# Altium schematic sheet ANALOG_CIRCUITS.SchDoc
size 482 x 304 mm; SheetNumber: 9; SheetTotal: 14
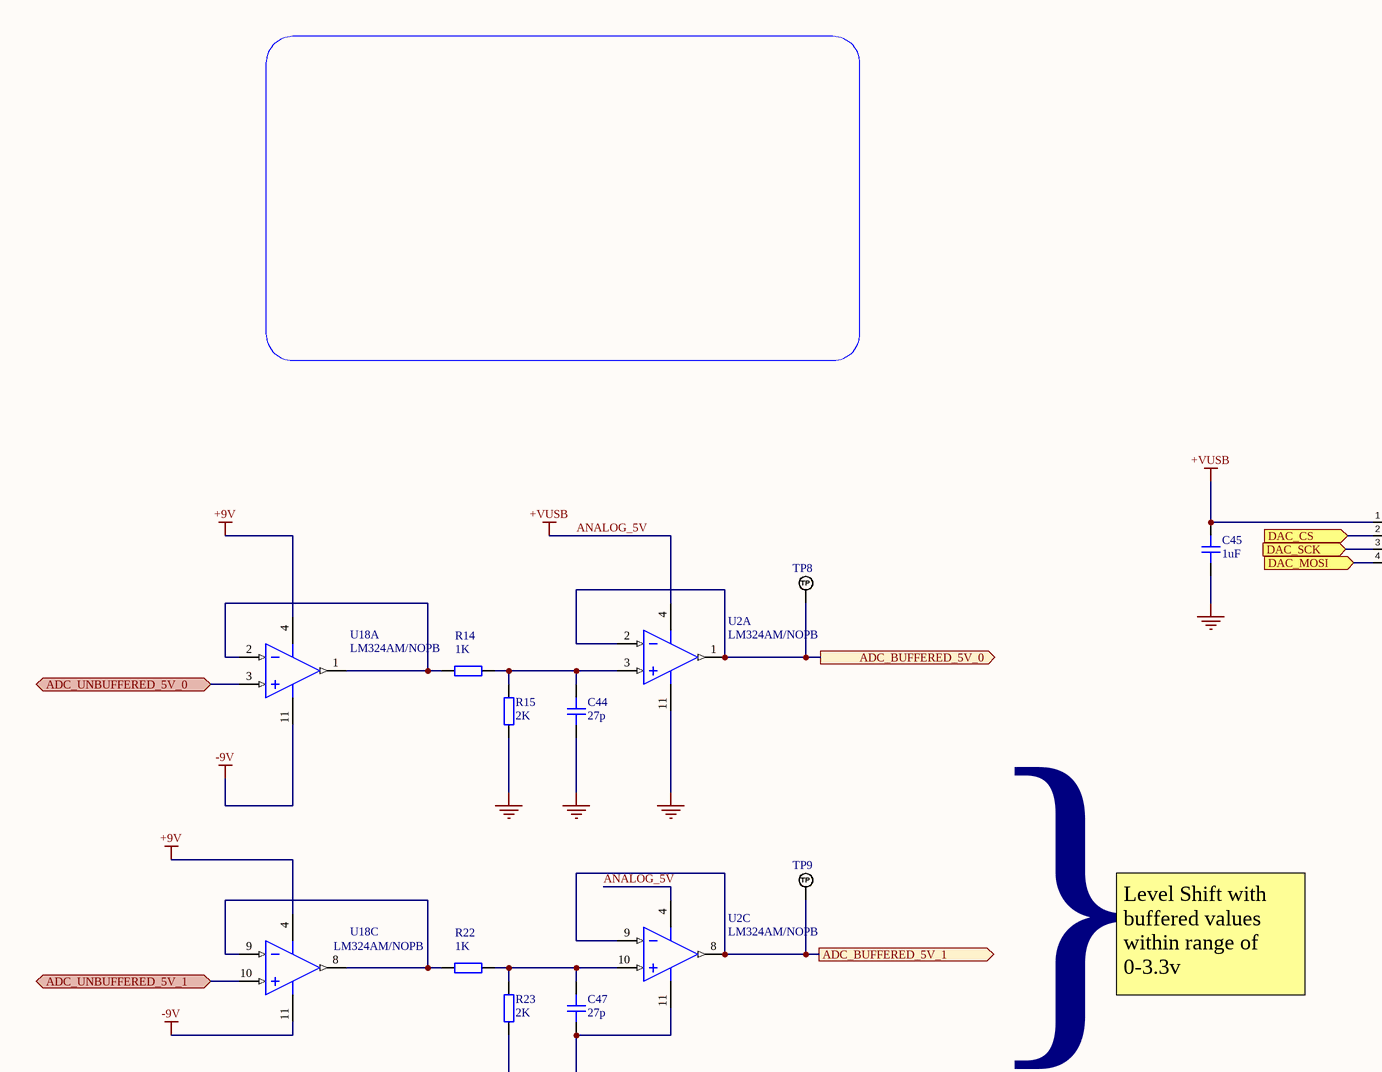
[diagram p0: ANALOG_CIRCUITS.SchDoc, top left]
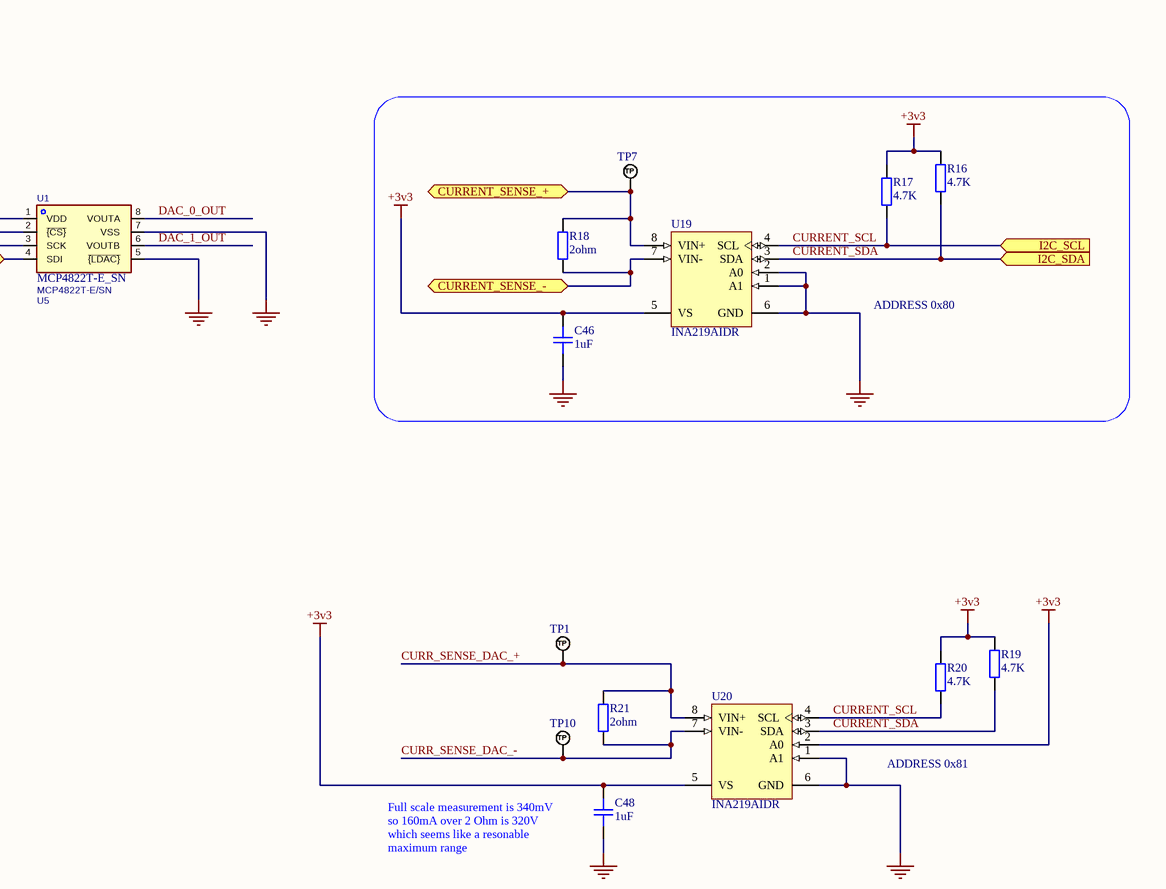
[diagram p1: ANALOG_CIRCUITS.SchDoc, top right]
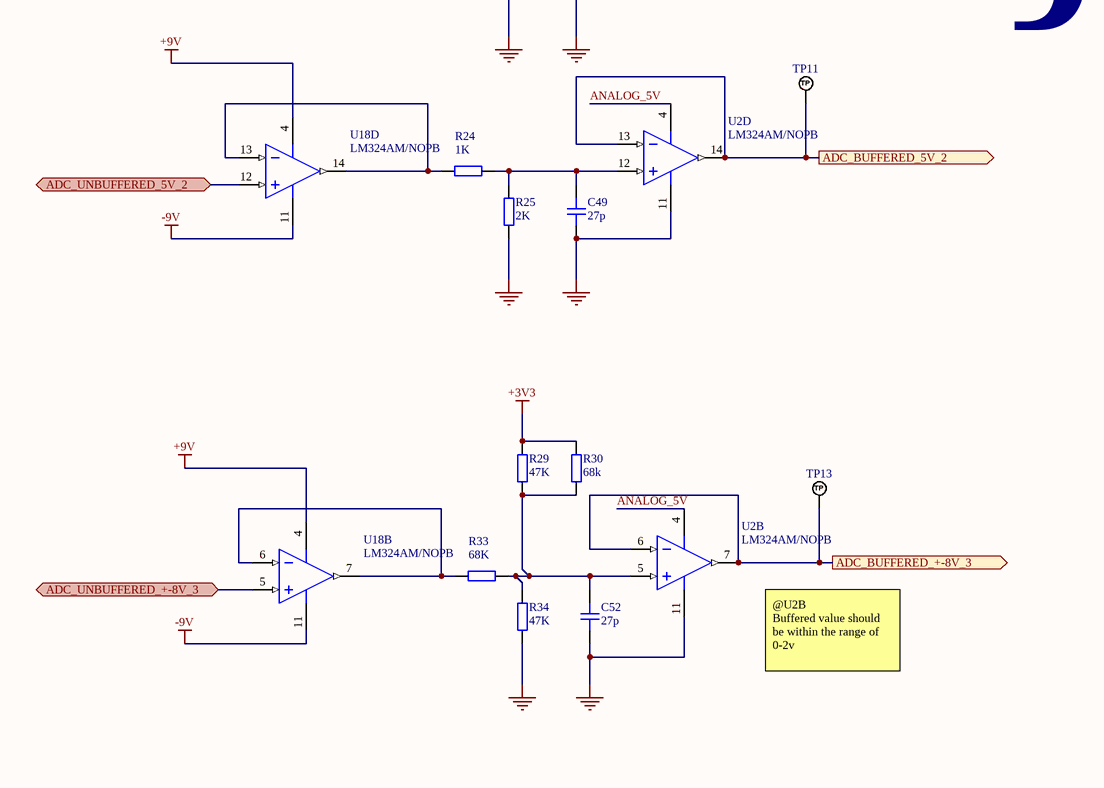
[diagram p2: ANALOG_CIRCUITS.SchDoc, bottom left]
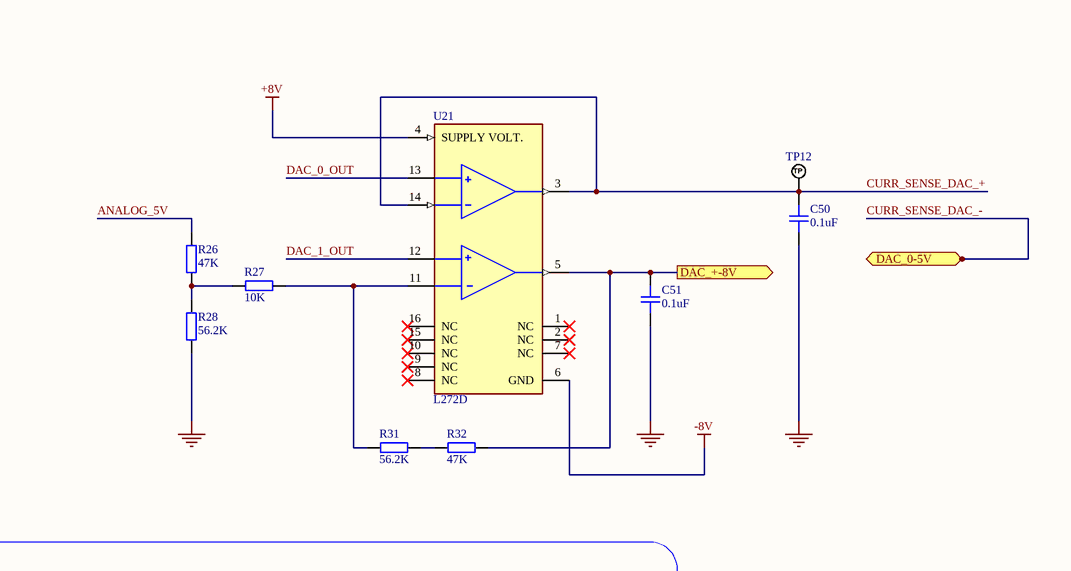
[diagram p3: ANALOG_CIRCUITS.SchDoc, bottom right]

## Parts
C44  27p  [CAP_0603]
C45  1uF  [CAP_0603]
C46  1uF  [CAP_0603]
C47  27p  [CAP_0603]
C48  1uF  [CAP_0603]
C49  27p  [CAP_0603]
C50  0.1uF  [CAP_0603]
C51  0.1uF  [CAP_0603]
C52  27p  [CAP_0603]
R14  1K  [RES_0603]
R15  2K  [RES_0603]
R16  4.7K  [RES_0603]
R17  4.7K  [RES_0603]
R18  2ohm  [RES_0603]
R19  4.7K  [RES_0603]
R20  4.7K  [RES_0603]
R21  2ohm  [RES_0603]
R22  1K  [RES_0603]
R23  2K  [RES_0603]
R24  1K  [RES_0603]
R25  2K  [RES_0603]
R26  47K  [RES_0603]
R27  10K  [RES_0603]
R28  56.2K  [RES_0603]
R29  47K  [RES_0603]
R30  68k  [RES_0603]
R31  56.2K  [RES_0603]
R32  47K  [RES_0603]
R33  68K  [RES_0603]
R34  47K  [RES_0603]
TP1  TP_NOBOM  [PAD_RND_1MM]  (value not drawn)  (no BOM)
TP7  TP_NOBOM  [PAD_RND_1MM]  (value not drawn)  (no BOM)
TP8  TP_NOBOM  [PAD_RND_1MM]  (value not drawn)  (no BOM)
TP9  TP_NOBOM  [PAD_RND_1MM]  (value not drawn)  (no BOM)
TP10  TP_NOBOM  [PAD_RND_1MM]  (value not drawn)  (no BOM)
TP11  TP_NOBOM  [PAD_RND_1MM]  (value not drawn)  (no BOM)
TP12  TP_NOBOM  [PAD_RND_1MM]  (value not drawn)  (no BOM)
TP13  TP_NOBOM  [PAD_RND_1MM]  (value not drawn)  (no BOM)
U1  MCP4822T-E_SN  value MCP4822T-E/SN  Reference: U5  [SOIC-8_L4.9-W3.9-P1.27-LS6.0-BL]
U2  LM324AM/NOPB  [D0014A_M]  (parts A,B,C,D of 4)
U18  LM324AM/NOPB  [D0014A_M]  (parts A,B,C,D of 4)
U19  INA219AIDR  [D0008A_L]
U20  INA219AIDR  [D0008A_L]
U21  L272D  [FP-SO16_Narrow-0016020-IPC_C]

## Blocks framed on the sheet
ADDRESS 0x80: C46 R16-R18 TP7 U19

## Ports
ADC_BUFFERED_5V_0 (out), ADC_BUFFERED_5V_1 (out), ADC_BUFFERED_5V_2 (out), ADC_BUFFERED_+-8V_3 (out), ADC_UNBUFFERED_5V_0 (bidir), ADC_UNBUFFERED_5V_1 (bidir), ADC_UNBUFFERED_5V_2 (bidir), ADC_UNBUFFERED_+-8V_3 (bidir), CURRENT_SENSE_+ (bidir), CURRENT_SENSE_- (bidir), DAC_0-5V (bidir), DAC_+-8V (out), DAC_CS (in), DAC_MOSI (in), DAC_SCK (in), I2C_SCL (in), I2C_SDA (in)

## Nets
+3V3: C46.2 C48.2 R16.2 R17.2 R19.2 R20.2 R29.2 R30.2 U19.5(VS) U20.2(A0) U20.5(VS)
+8V: U21.4(SUPPLY_VOLT.)
+9V: U18.4(V+)
-8V: U21.6(GND)
-9V: U18.11(GND)
ANALOG_5V: C45.2 R26.2 U1.1(VDD) U2.4(V+)  [also labelled +VUSB]
GND: C44.1 C45.1 C46.1 C47.1 C48.1 C49.1 C50.1 C51.1 C52.1 R15.1 R23.1 R25.1 R28.1 R34.1 U1.5(~{{LDAC}}) U1.7(VSS) U2.11(GND) U19.1(A1) U19.2(A0) U19.6(GND) U20.1(A1) U20.6(GND)
ADC_BUFFERED_5V_0: TP8.1(TP) U2.1(OUT1) U2.2(IN1-) ; port ADC_BUFFERED_5V_0
ADC_BUFFERED_5V_1: TP9.1(TP) U2.8(OUT3) U2.9(IN3-) ; port ADC_BUFFERED_5V_1
ADC_BUFFERED_5V_2: TP11.1(TP) U2.13(IN4-) U2.14(OUT4) ; port ADC_BUFFERED_5V_2
ADC_BUFFERED_+-8V_3: TP13.1(TP) U2.6(IN2-) U2.7(OUT2) ; port ADC_BUFFERED_+-8V_3
ADC_UNBUFFERED_5V_0: U18.3(IN1+) ; port ADC_UNBUFFERED_5V_0
ADC_UNBUFFERED_5V_1: U18.10(IN3+) ; port ADC_UNBUFFERED_5V_1
ADC_UNBUFFERED_5V_2: U18.12(IN4+) ; port ADC_UNBUFFERED_5V_2
ADC_UNBUFFERED_+-8V_3: U18.5(IN2+) ; port ADC_UNBUFFERED_+-8V_3
CURR_SENSE_DAC_+: C50.2 R21.2 TP1.1(TP) TP12.1(TP) U20.8(VIN+) U21.3(OUTPUT_1) U21.14(INPUT-_1)
CURR_SENSE_DAC_-: port DAC_0-5V
CURRENT_SCL: R17.1 R20.1 U19.4(SCL) U20.4(SCL) ; port I2C_SCL
CURRENT_SDA: R16.1 R19.1 U19.3(SDA) U20.3(SDA) ; port I2C_SDA
CURRENT_SENSE_+: R18.2 TP7.1(TP) U19.8(VIN+) ; port CURRENT_SENSE_+
CURRENT_SENSE_-: R18.1 U19.7(VIN-) ; port CURRENT_SENSE_-
DAC_0_OUT: U1.8(VOUTA) U21.13(INPUT+_1)
DAC_1_OUT: U1.6(VOUTB) U21.12(INPUT+_2)
DAC_+-8V: C51.2 R32.1 U21.5(OUTPUT_2) ; port DAC_+-8V
DAC_CS: U1.2(~{{CS}}) ; port DAC_CS
DAC_MOSI: U1.4(SDI) ; port DAC_MOSI
DAC_SCK: U1.3(SCK) ; port DAC_SCK
NetC44_2: C44.2 R14.2 R15.2 U2.3(IN1+)
NetC47_2: C47.2 R22.2 R23.2 U2.10(IN3+)
NetC49_2: C49.2 R24.2 R25.2 U2.12(IN4+)
NetC52_2: C52.2 R29.1 R30.1 R33.2 R34.2 U2.5(IN2+)
NetR14_1: R14.1 U18.1(OUT1) U18.2(IN1-)
NetR21_1: R21.1 TP10.1(TP) U20.7(VIN-)
NetR22_1: R22.1 U18.8(OUT3) U18.9(IN3-)
NetR24_1: R24.1 U18.13(IN4-) U18.14(OUT4)
NetR26_1: R26.1 R27.2 R28.2
NetR27_1: R27.1 R31.2 U21.11(INPUT-_2)
NetR31_1: R31.1 R32.2
NetR33_1: R33.1 U18.6(IN2-) U18.7(OUT2)

Not connected (* = marked no-connect by the designer): U21 1(NC)* 2(NC)* 7(NC)* 8(NC)* 9(NC)* 10(NC)* 15(NC)* 16(NC)*

## Notes on the sheet
- Level Shift with buffered values within range of 0-3.3v
- ADDRESS 0x81
- }
- Full scale measurement is 340mV
  so 160mA over 2 Ohm is 320V
  which seems like a resonable maximum range
- @U2B
  Buffered value should be within the range of 0-2v

## Library data of the parts
C44-C52 = CAP_0603: Capacitor SMD 0603; Manufacturer: *; Manufacturer Part Number: *; Distributor Link: *; LCSC: *; Rating: *; Dielectric: *
R14-R34 = RES_0603: Resistor SMD 0603; Manufacturer: *; Manufacturer Part Number: *; Distributor Link: *; LCSC: *
TP1 TP7-TP13 = TEST_POINT_RND_1MM: Test Point Round 1mm (NO BOM)
U2 U18 = CMP-0055-00733-3: Low Power Quad Operational Amplifier, 14-pin Narrow SOIC, Pb-Free; Manufacturer: Texas Instruments; PowerWise: N; PackageTopMarking: NSUZXYTTE#*LM324AM; CompType: Amplifiers; RoHS: Y; Code_IPC: SOIC127P600-14; ComponentLink1Description: Datasheet URL; PackageDescription: Molded Package S.O., .150in Wide, 14 Lead; PinCount: 14; Package Reference: D0014A; ComponentLink1URL: http://www.ti.com/general/docs/lit/getliterature.tsp?genericPartNumber=LM324-N&fileType=pdf; Code_JEDEC: MS-012AB
U19 U20 = CMP-0704-00003-2: Zero-Drift, Bi-Directional Current / Power Monitor, 3 to 5.5 V, -40 to 125 degC, 8-pin SOIC (D8), Green (RoHS & no Sb/Br); Manufacturer: Texas Instruments; Common Mode Range(Min)(V): 0; SubFamily: Current Shunt Monitor; Rating: Catalog; Input Offset (+/-)(Max)(uV): 100; Vs(Max)(V): 5.5; Common Mode Range(Max)(V): 26; Quiescent Current (+/-)(Typ)(mA): 0.7; Vs(Min)(V): 3; Gain(V/V): 1, 0.5, 0.25, 0.125; Small-Signal Bandwidth(Typ)(MHz): 0.011; PackageReference: D0008A; ComponentLink1URL: http://www.ti.com/; Eco-Plan: Green (RoHS & no Sb/Br); ComponentLink2URL: http://www.ti.com/general/docs/lit/getliterature.tsp?genericPartNumber=INA219&fileType=pdf; ComponentLink1Description: Manufacturer URL; ComponentLink3Description: Package Specification; Mounting Technology: Surface Mount; PackageDescription: 8-Pin Plastic Small Outline, Body 4.9 x 3.9 mm, Pitch 1.27 mm; ComponentLink3URL: http://www.ti.com/lit/ml/msoi002j/msoi002j.pdf; DatasheetVersion: SBOS448F; PackageVersion: 4040047-3/M, 06/2011; PartNumber: INA219AIDR; Code_JEDEC: MS-012; ComponentLink2Description: Datasheet; CMRR(Min)(dB): 100
U21 = CMP-12131-000001-1: IC OPAMP GP 2 CIRCUIT 16SO; Manufacturer: STMicroelectronics; Min Dual Supply Voltage: 2V; Number Of Channels: 2; Max Supply Voltage: 28V; Max Dual Supply Voltage: 14V; Voltage Gain: 50-70dB; Max Junction Temp: +150°C; Standoff Height: 0.1mm; Nominal Supply Current: 7.5-8mA; Gain Bandwidth: 350kHz; Input Bias Current: 0.3uA; Output Current Per Channel: 1A; Input Offset Voltage: 15mV; Min Supply Voltage: 4V; Ipc Land Pattern Name: SOIC127P600X175-16; Height: 1.75mm; ComponentLink2URL: https://www.st.com/resource/en/datasheet/l272.pdf; Device Class L3: Amplifiers - Op Amps; RoHS: TRUE; Package: SO16 Narrow-0016020; Octopart: https://octopart.com/l272d-stmicroelectronics-410409; ComponentLink2Description: Datasheet; Automotive: No; Category: IC; Device Class L1: Integrated Circuits (ICs); Temperature Range High: +85°C; Temperature Range Low: -40°C; Mouser Description: Operational Amplifier, Dual, 250 Khz, 2, 1 V/ S, 4V To 28V, Soic, 16 Rohs Compliant: Yes; Digikey Description: IC OPAMP GP 2 CIRCUIT 16SO; Device Class L2: Linear ICs; Temperature: -40°C to +85°C; Manufacturer Part Number: L272D; Lead Free: Yes
U1 = MCP4822T-E_SN: Footprint: easyeda2kicad:SOIC-8_L4.9-W3.9-P1.27-LS6.0-BL; LCSC Part: C623653